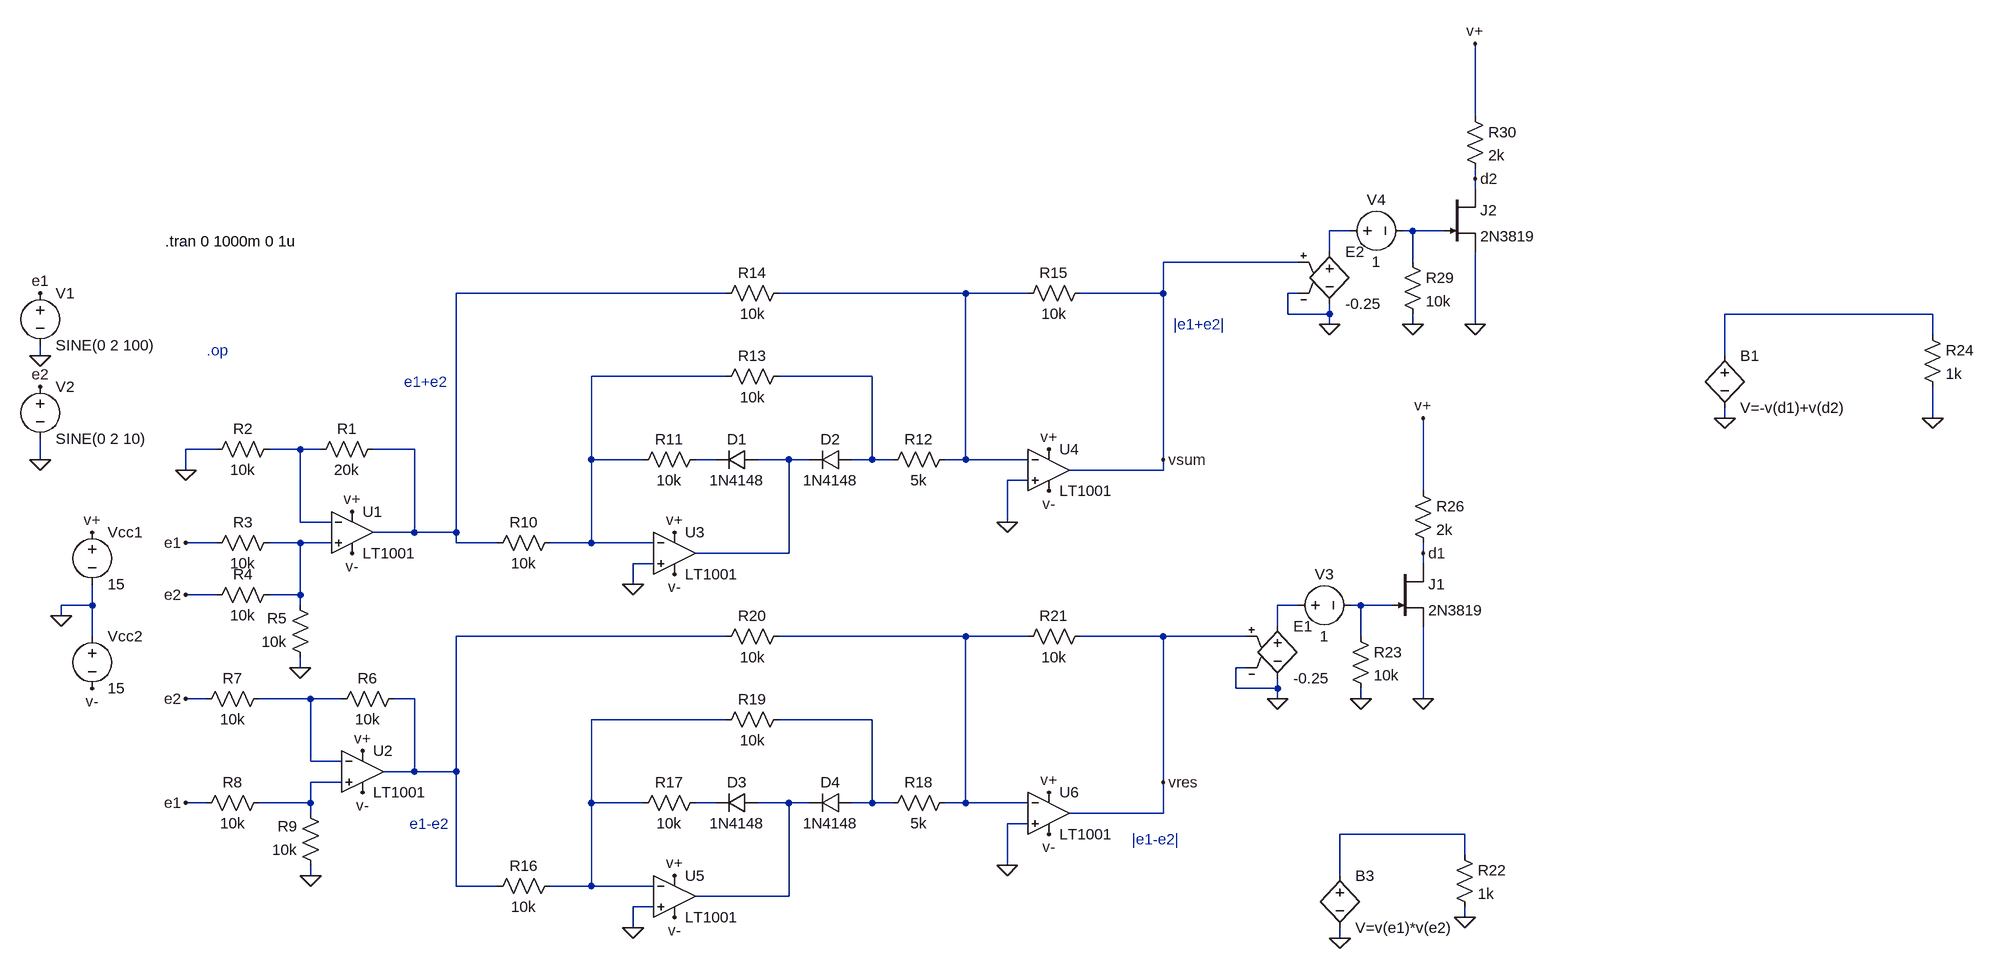
[diagram p0: schematic Multiplicador4cua2.asc]
Multiplicador4cua2.asc, the LTspice schematic file:
Version 4
SHEET 1 2900 740
WIRE 2112 -560 2112 -672
WIRE 2112 -464 2112 -480
WIRE 2112 -448 2112 -464
WIRE 1920 -384 1888 -384
WIRE 2016 -384 2000 -384
WIRE 2064 -384 2016 -384
WIRE 1888 -352 1888 -384
WIRE 1840 -336 1632 -336
WIRE 2016 -336 2016 -384
WIRE 960 -288 544 -288
WIRE 1328 -288 1040 -288
WIRE 1424 -288 1328 -288
WIRE 1632 -288 1632 -336
WIRE 1632 -288 1504 -288
WIRE 1840 -288 1824 -288
WIRE 1824 -256 1824 -288
WIRE 1888 -256 1888 -272
WIRE 1888 -256 1824 -256
WIRE 2816 -256 2496 -256
WIRE 1888 -240 1888 -256
WIRE 2016 -240 2016 -256
WIRE 2112 -240 2112 -352
WIRE 2816 -224 2816 -256
WIRE -96 -192 -96 -208
WIRE 2496 -192 2496 -256
WIRE 960 -160 752 -160
WIRE 1184 -160 1040 -160
WIRE 2496 -96 2496 -112
WIRE 2816 -96 2816 -144
WIRE 176 -48 128 -48
WIRE 304 -48 256 -48
WIRE 336 -48 304 -48
WIRE 480 -48 416 -48
WIRE -96 -32 -96 -64
WIRE 752 -32 752 -160
WIRE 832 -32 752 -32
WIRE 944 -32 912 -32
WIRE 1056 -32 1008 -32
WIRE 1088 -32 1056 -32
WIRE 1184 -32 1184 -160
WIRE 1184 -32 1152 -32
WIRE 1216 -32 1184 -32
WIRE 1328 -32 1328 -288
WIRE 1328 -32 1296 -32
WIRE 1424 -32 1328 -32
WIRE 1632 -32 1632 -288
WIRE 128 -16 128 -48
WIRE 1632 -16 1632 -32
WIRE 1632 -16 1488 -16
WIRE 1424 0 1392 0
WIRE 2032 16 2032 -96
WIRE 304 64 304 -48
WIRE 352 64 304 64
WIRE 1392 64 1392 0
WIRE 480 80 480 -48
WIRE 480 80 416 80
WIRE 544 80 544 -288
WIRE 544 80 480 80
WIRE 176 96 128 96
WIRE 304 96 256 96
WIRE 352 96 304 96
WIRE 544 96 544 80
WIRE 608 96 544 96
WIRE 752 96 752 -32
WIRE 752 96 688 96
WIRE 848 96 752 96
WIRE 1056 112 1056 -32
WIRE 1056 112 912 112
WIRE 2032 112 2032 96
WIRE 848 128 816 128
WIRE 2032 128 2032 112
WIRE 816 160 816 128
WIRE 176 176 128 176
WIRE 304 176 304 96
WIRE 304 176 256 176
WIRE -16 192 -16 160
WIRE -16 192 -64 192
WIRE 304 192 304 176
WIRE 1840 192 1808 192
WIRE 1936 192 1920 192
WIRE 1984 192 1936 192
WIRE -64 208 -64 192
WIRE 1808 224 1808 192
WIRE -16 240 -16 192
WIRE 960 240 544 240
WIRE 1328 240 1040 240
WIRE 1424 240 1328 240
WIRE 1632 240 1504 240
WIRE 1760 240 1632 240
WIRE 1936 240 1936 192
WIRE 304 288 304 272
WIRE 1760 288 1744 288
WIRE 1744 320 1744 288
WIRE 1808 320 1808 304
WIRE 1808 320 1744 320
WIRE 160 336 128 336
WIRE 320 336 240 336
WIRE 368 336 320 336
WIRE 480 336 448 336
WIRE 1808 336 1808 320
WIRE 1936 336 1936 320
WIRE 2032 336 2032 224
WIRE 960 368 752 368
WIRE 1184 368 1040 368
WIRE 320 432 320 336
WIRE 368 432 320 432
WIRE 480 448 480 336
WIRE 480 448 432 448
WIRE 544 448 544 240
WIRE 544 448 480 448
WIRE 368 464 320 464
WIRE 1632 464 1632 240
WIRE 160 496 128 496
WIRE 320 496 320 464
WIRE 320 496 240 496
WIRE 752 496 752 368
WIRE 832 496 752 496
WIRE 944 496 912 496
WIRE 1056 496 1008 496
WIRE 1088 496 1056 496
WIRE 1184 496 1184 368
WIRE 1184 496 1152 496
WIRE 1216 496 1184 496
WIRE 1328 496 1328 240
WIRE 1328 496 1296 496
WIRE 1424 496 1328 496
WIRE 320 512 320 496
WIRE 1632 512 1632 464
WIRE 1632 512 1488 512
WIRE 1424 528 1392 528
WIRE 2096 544 1904 544
WIRE 2096 576 2096 544
WIRE 1392 592 1392 528
WIRE 320 608 320 592
WIRE 1904 608 1904 544
WIRE 544 624 544 448
WIRE 608 624 544 624
WIRE 752 624 752 496
WIRE 752 624 688 624
WIRE 848 624 752 624
WIRE 1056 640 1056 496
WIRE 1056 640 912 640
WIRE 848 656 816 656
WIRE 2096 672 2096 656
WIRE 816 688 816 656
WIRE 1904 704 1904 688
FLAG -64 208 0
FLAG -16 80 v+
FLAG -16 320 v-
FLAG 384 48 v+
FLAG 400 416 v+
FLAG 400 480 v-
FLAG 384 112 v-
FLAG 128 -16 0
FLAG 304 288 0
FLAG 320 608 0
FLAG -96 -32 0
FLAG -96 -192 0
FLAG -96 -288 e1
FLAG -96 -144 e2
FLAG 128 96 e1
FLAG 128 496 e1
FLAG 128 176 e2
FLAG 128 336 e2
FLAG 880 80 v+
FLAG 880 144 v-
FLAG 1456 -48 v+
FLAG 1456 16 v-
FLAG 816 160 0
FLAG 1392 64 0
FLAG 880 608 v+
FLAG 880 672 v-
FLAG 1456 480 v+
FLAG 1456 544 v-
FLAG 816 688 0
FLAG 1392 592 0
FLAG 1632 -32 vsum
FLAG 1632 464 vres
FLAG 1904 704 0
FLAG 2096 672 0
FLAG 1808 336 0
FLAG 1936 336 0
FLAG 2032 336 0
FLAG 2032 -96 v+
FLAG 1888 -240 0
FLAG 2016 -240 0
FLAG 2112 -240 0
FLAG 2112 -672 v+
FLAG 2032 112 d1
FLAG 2112 -464 d2
FLAG 2496 -96 0
FLAG 2816 -96 0
DATAFLAG 544 -16 ""
DATAFLAG 1632 -128 ""
DATAFLAG 1632 352 ""
SYMBOL voltage -16 64 R0
WINDOW 123 0 0 Left 0
WINDOW 39 0 0 Left 0
SYMATTR InstName Vcc1
SYMATTR Value 15
SYMBOL voltage -16 224 R0
WINDOW 123 0 0 Left 0
WINDOW 39 0 0 Left 0
SYMATTR InstName Vcc2
SYMATTR Value 15
SYMBOL OpAmps\\LT1001 384 16 R0
SYMATTR InstName U1
SYMBOL OpAmps\\LT1001 400 384 R0
SYMATTR InstName U2
SYMBOL res 432 -64 R90
WINDOW 0 0 56 VBottom 2
WINDOW 3 32 56 VTop 2
SYMATTR InstName R1
SYMATTR Value 20k
SYMBOL res 272 -64 R90
WINDOW 0 0 56 VBottom 2
WINDOW 3 32 56 VTop 2
SYMATTR InstName R2
SYMATTR Value 10k
SYMBOL res 272 80 R90
WINDOW 0 0 56 VBottom 2
WINDOW 3 32 56 VTop 2
SYMATTR InstName R3
SYMATTR Value 10k
SYMBOL res 272 160 R90
WINDOW 0 0 56 VBottom 2
WINDOW 3 32 56 VTop 2
SYMATTR InstName R4
SYMATTR Value 10k
SYMBOL res 320 288 R180
WINDOW 0 36 76 Left 2
WINDOW 3 36 40 Left 2
SYMATTR InstName R5
SYMATTR Value 10k
SYMBOL res 464 320 R90
WINDOW 0 0 56 VBottom 2
WINDOW 3 32 56 VTop 2
SYMATTR InstName R6
SYMATTR Value 10k
SYMBOL res 256 320 R90
WINDOW 0 0 56 VBottom 2
WINDOW 3 32 56 VTop 2
SYMATTR InstName R7
SYMATTR Value 10k
SYMBOL res 256 480 R90
WINDOW 0 0 56 VBottom 2
WINDOW 3 32 56 VTop 2
SYMATTR InstName R8
SYMATTR Value 10k
SYMBOL res 336 608 R180
WINDOW 0 36 76 Left 2
WINDOW 3 36 40 Left 2
SYMATTR InstName R9
SYMATTR Value 10k
SYMBOL voltage -96 -304 R0
WINDOW 123 0 0 Left 0
WINDOW 39 0 0 Left 0
SYMATTR InstName V1
SYMATTR Value SINE(0 2 100)
SYMBOL voltage -96 -160 R0
WINDOW 123 0 0 Left 0
WINDOW 39 0 0 Left 0
SYMATTR InstName V2
SYMATTR Value SINE(0 2 10)
SYMBOL OpAmps\\LT1001 880 48 R0
SYMATTR InstName U3
SYMBOL OpAmps\\LT1001 1456 -80 R0
SYMATTR InstName U4
SYMBOL res 704 80 R90
WINDOW 0 0 56 VBottom 2
WINDOW 3 32 56 VTop 2
SYMATTR InstName R10
SYMATTR Value 10k
SYMBOL res 928 -48 R90
WINDOW 0 0 56 VBottom 2
WINDOW 3 32 56 VTop 2
SYMATTR InstName R11
SYMATTR Value 10k
SYMBOL diode 1008 -48 R90
WINDOW 0 0 32 VBottom 2
WINDOW 3 32 32 VTop 2
SYMATTR InstName D1
SYMATTR Value 1N4148
SYMBOL diode 1152 -48 R90
WINDOW 0 0 32 VBottom 2
WINDOW 3 32 32 VTop 2
SYMATTR InstName D2
SYMATTR Value 1N4148
SYMBOL res 1312 -48 R90
WINDOW 0 0 56 VBottom 2
WINDOW 3 32 56 VTop 2
SYMATTR InstName R12
SYMATTR Value 5k
SYMBOL res 1056 -176 R90
WINDOW 0 0 56 VBottom 2
WINDOW 3 32 56 VTop 2
SYMATTR InstName R13
SYMATTR Value 10k
SYMBOL res 1056 -304 R90
WINDOW 0 0 56 VBottom 2
WINDOW 3 32 56 VTop 2
SYMATTR InstName R14
SYMATTR Value 10k
SYMBOL res 1520 -304 R90
WINDOW 0 0 56 VBottom 2
WINDOW 3 32 56 VTop 2
SYMATTR InstName R15
SYMATTR Value 10k
SYMBOL OpAmps\\LT1001 880 576 R0
SYMATTR InstName U5
SYMBOL OpAmps\\LT1001 1456 448 R0
SYMATTR InstName U6
SYMBOL res 704 608 R90
WINDOW 0 0 56 VBottom 2
WINDOW 3 32 56 VTop 2
SYMATTR InstName R16
SYMATTR Value 10k
SYMBOL res 928 480 R90
WINDOW 0 0 56 VBottom 2
WINDOW 3 32 56 VTop 2
SYMATTR InstName R17
SYMATTR Value 10k
SYMBOL diode 1008 480 R90
WINDOW 0 0 32 VBottom 2
WINDOW 3 32 32 VTop 2
SYMATTR InstName D3
SYMATTR Value 1N4148
SYMBOL diode 1152 480 R90
WINDOW 0 0 32 VBottom 2
WINDOW 3 32 32 VTop 2
SYMATTR InstName D4
SYMATTR Value 1N4148
SYMBOL res 1312 480 R90
WINDOW 0 0 56 VBottom 2
WINDOW 3 32 56 VTop 2
SYMATTR InstName R18
SYMATTR Value 5k
SYMBOL res 1056 352 R90
WINDOW 0 0 56 VBottom 2
WINDOW 3 32 56 VTop 2
SYMATTR InstName R19
SYMATTR Value 10k
SYMBOL res 1056 224 R90
WINDOW 0 0 56 VBottom 2
WINDOW 3 32 56 VTop 2
SYMATTR InstName R20
SYMATTR Value 10k
SYMBOL res 1520 224 R90
WINDOW 0 0 56 VBottom 2
WINDOW 3 32 56 VTop 2
SYMATTR InstName R21
SYMATTR Value 10k
SYMBOL bv 1904 592 R0
SYMATTR InstName B3
SYMATTR Value V=v(e1)*v(e2)
SYMBOL res 2080 560 R0
SYMATTR InstName R22
SYMATTR Value 1k
SYMBOL e 1808 208 R0
SYMATTR InstName E1
SYMATTR Value -0.25
SYMBOL res 1920 224 R0
SYMATTR InstName R23
SYMATTR Value 10k
SYMBOL njf 1984 128 R0
SYMATTR InstName J1
SYMATTR Value 2N3819
SYMBOL res 2016 0 R0
SYMATTR InstName R26
SYMATTR Value 2k
SYMBOL voltage 1824 192 R270
WINDOW 0 32 56 VTop 2
WINDOW 3 -32 56 VBottom 2
WINDOW 123 0 0 Left 0
WINDOW 39 0 0 Left 0
SYMATTR InstName V3
SYMATTR Value 1
SYMBOL e 1888 -368 R0
SYMATTR InstName E2
SYMATTR Value -0.25
SYMBOL res 2000 -352 R0
SYMATTR InstName R29
SYMATTR Value 10k
SYMBOL njf 2064 -448 R0
SYMATTR InstName J2
SYMATTR Value 2N3819
SYMBOL res 2096 -576 R0
SYMATTR InstName R30
SYMATTR Value 2k
SYMBOL voltage 1904 -384 R270
WINDOW 0 32 56 VTop 2
WINDOW 3 -32 56 VBottom 2
WINDOW 123 0 0 Left 0
WINDOW 39 0 0 Left 0
SYMATTR InstName V4
SYMATTR Value 1
SYMBOL bv 2496 -208 R0
SYMATTR InstName B1
SYMATTR Value V=-v(d1)+v(d2)
SYMBOL res 2800 -240 R0
SYMATTR InstName R24
SYMATTR Value 1k
TEXT 160 -200 Left 2 ;.op
TEXT 464 -152 Left 2 ;e1+e2
TEXT 472 528 Left 2 ;e1-e2
TEXT 1648 -240 Left 2 ;|e1+e2|
TEXT 1584 552 Left 2 ;|e1-e2|
TEXT 96 -368 Left 2 !.tran 0 1000m 0 1u

The netlist it stands for:
* Multiplicador4cua2.asc
Vcc1 v+ 0 15
Vcc2 0 v- 15
XU1 N011 N008 v+ v- N003 LT1001  ; pins In+ In- V+ V- OUT
XU2 N019 N016 v+ v- N014 LT1001  ; pins In+ In- V+ V- OUT
R1 N003 N008 20k
R2 N008 0 10k
R3 N011 e1 10k
R4 N011 e2 10k
R5 0 N011 10k
R6 N014 N016 10k
R7 N016 e2 10k
R8 N019 e1 10k
R9 0 N019 10k
V1 e1 0 SINE(0 2 100)
V2 e2 0 SINE(0 2 10)
XU3 0 N006 v+ v- N010 LT1001  ; pins In+ In- V+ V- OUT
XU4 0 N004 v+ v- vsum LT1001  ; pins In+ In- V+ V- OUT
R10 N006 N003 10k
R11 N009 N006 10k
D1 N010 N009 1N4148
D2 N007 N010 1N4148
R12 N004 N007 5k
R13 N007 N006 10k
R14 N004 N003 10k
R15 vsum N004 10k
XU5 0 N017 v+ v- N021 LT1001  ; pins In+ In- V+ V- OUT
XU6 0 N015 v+ v- vres LT1001  ; pins In+ In- V+ V- OUT
R16 N017 N014 10k
R17 N020 N017 10k
D3 N021 N020 1N4148
D4 N018 N021 1N4148
R18 N015 N018 5k
R19 N018 N017 10k
R20 N015 N014 10k
R21 vres N015 10k
B3 N022 0 V=v(e1)*v(e2)
R22 N022 0 1k
E1 N012 0 vres 0 -0.25
R23 N013 0 10k
J1 d1 N013 0 2N3819
R26 v+ d1 2k
V3 N012 N013 1
E2 N001 0 vsum 0 -0.25
R29 N002 0 10k
J2 d2 N002 0 2N3819
R30 v+ d2 2k
V4 N001 N002 1
B1 N005 0 V=-v(d1)+v(d2)
R24 N005 0 1k
.model D D
.lib standard.dio
.model NJF NJF
.model PJF PJF
.lib standard.jft
* .op
* e1+e2
* e1-e2
* |e1+e2|
* |e1-e2|
.tran 0 1000m 0 1u
.lib LTC.lib
.backanno
.end